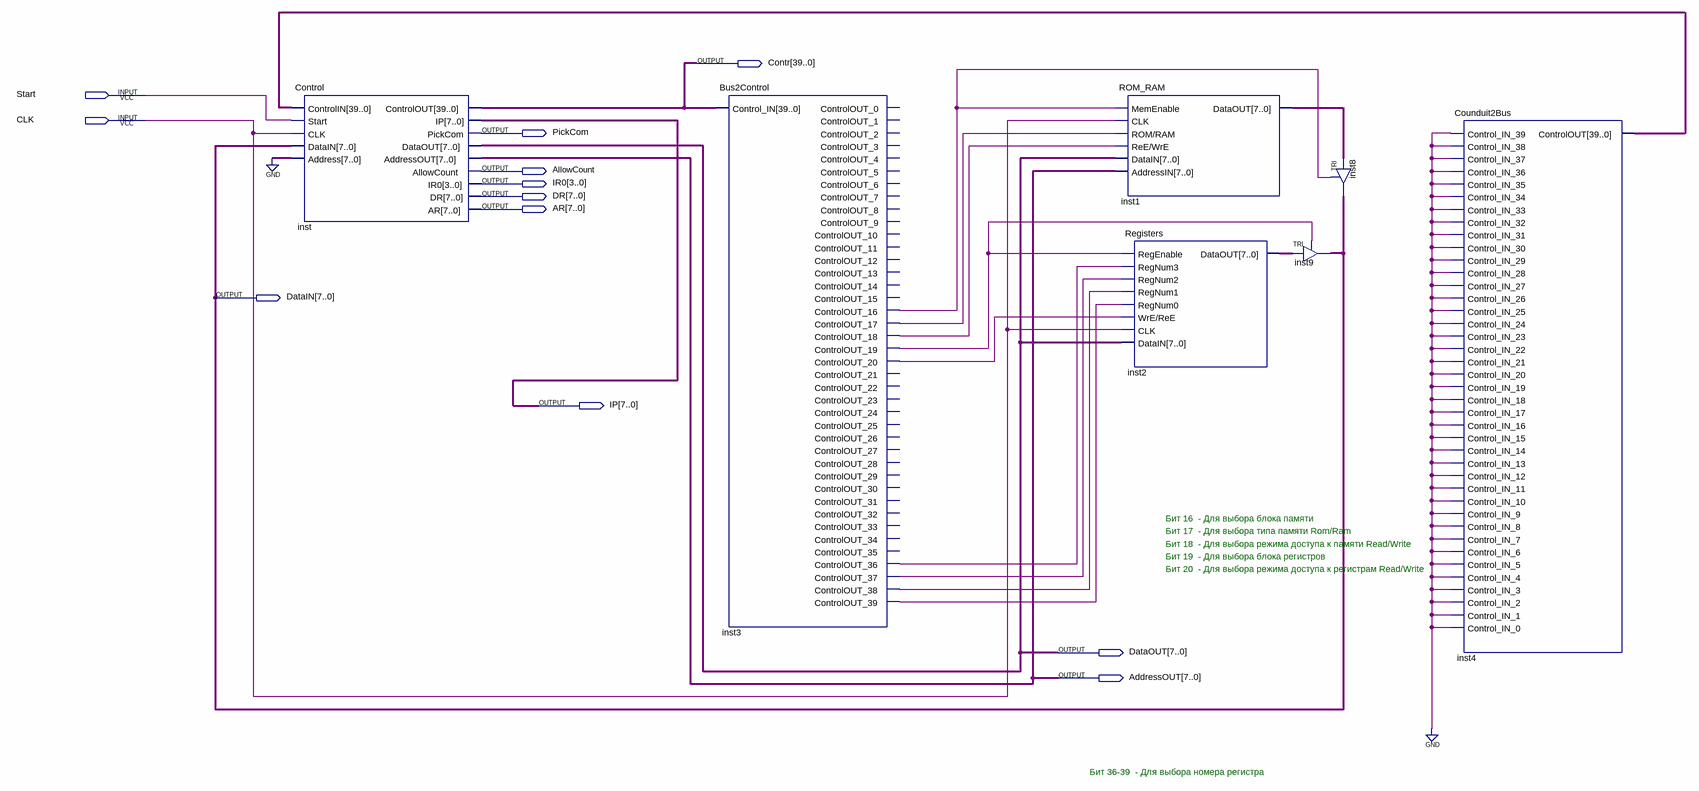
[diagram p0: schematic sheet]
// Quartus schematic lab4.bdf as structural Verilog: 7 symbols, 12 pins
module lab4 (
  input  Start,
  input  CLK,
  output [39:0] Contr,
  output PickCom,
  output AllowCount,
  output [3:0] IR0,
  output [7:0] DR,
  output [7:0] AR,
  output [7:0] DataIN,
  output [7:0] IP,
  output [7:0] DataOUT,
  output [7:0] AddressOUT
);

  wire inst3_controlout_16, inst3_controlout_17, inst3_controlout_18, inst3_controlout_19,
       inst3_controlout_20, inst3_controlout_36, inst3_controlout_37, inst3_controlout_38,
       inst3_controlout_39;
  wire [7:0] inst1_dataout, inst2_dataout;
  wire [39:0] inst4_controlout;

  Control inst (
    .ControlIN(inst4_controlout), .Start(Start), .CLK(CLK), .DataIN(DataIN), .Address({8{1'b0}}),
    .ControlOUT(Contr), .IP(IP), .PickCom(PickCom), .DataOUT(DataOUT), .AddressOUT(AddressOUT),
    .AllowCount(AllowCount), .IR0(IR0), .DR(DR), .AR(AR));
  Bus2Control inst3 (
    .Control_IN(Contr), .ControlOUT_16(inst3_controlout_16), .ControlOUT_17(inst3_controlout_17),
    .ControlOUT_18(inst3_controlout_18), .ControlOUT_19(inst3_controlout_19),
    .ControlOUT_20(inst3_controlout_20), .ControlOUT_36(inst3_controlout_36),
    .ControlOUT_37(inst3_controlout_37), .ControlOUT_38(inst3_controlout_38),
    .ControlOUT_39(inst3_controlout_39));  // open: ControlOUT_0, ControlOUT_1, ControlOUT_2, ControlOUT_3, ControlOUT_4, ControlOUT_5, ControlOUT_6, ControlOUT_7, ControlOUT_8, ControlOUT_9, ControlOUT_10, ControlOUT_11, ControlOUT_12, ControlOUT_13, ControlOUT_14, ControlOUT_15, ControlOUT_21, ControlOUT_22, ControlOUT_23, ControlOUT_24, ControlOUT_25, ControlOUT_26, ControlOUT_27, ControlOUT_28, ControlOUT_29, ControlOUT_30, ControlOUT_31, ControlOUT_32, ControlOUT_33, ControlOUT_34, ControlOUT_35
  ROM_RAM inst1 (
    .MemEnable(inst3_controlout_16), .CLK(CLK), .\ROM/RAM (inst3_controlout_17),
    .\ReE/WrE (inst3_controlout_18), .DataIN(DataOUT), .AddressIN(AddressOUT), .DataOUT(inst1_dataout));
  Registers inst2 (
    .RegEnable(inst3_controlout_19), .RegNum3(inst3_controlout_36), .RegNum2(inst3_controlout_37),
    .RegNum1(inst3_controlout_38), .RegNum0(inst3_controlout_39), .\WrE/ReE (inst3_controlout_20), .CLK(CLK),
    .DataIN(DataOUT), .DataOUT(inst2_dataout));
  TRI inst9[7:0] (.IN(inst2_dataout), .OE(inst3_controlout_19), .OUT(DataIN));
  TRI inst8[7:0] (.IN(inst1_dataout), .OE(inst3_controlout_16), .OUT(DataIN));
  Counduit2Bus inst4 (
    .Control_IN_39(1'b0), .Control_IN_38(1'b0), .Control_IN_37(1'b0), .Control_IN_36(1'b0),
    .Control_IN_35(1'b0), .Control_IN_34(1'b0), .Control_IN_33(1'b0), .Control_IN_32(1'b0),
    .Control_IN_31(1'b0), .Control_IN_30(1'b0), .Control_IN_29(1'b0), .Control_IN_28(1'b0),
    .Control_IN_27(1'b0), .Control_IN_26(1'b0), .Control_IN_25(1'b0), .Control_IN_24(1'b0),
    .Control_IN_23(1'b0), .Control_IN_22(1'b0), .Control_IN_21(1'b0), .Control_IN_20(1'b0),
    .Control_IN_19(1'b0), .Control_IN_18(1'b0), .Control_IN_17(1'b0), .Control_IN_16(1'b0),
    .Control_IN_15(1'b0), .Control_IN_14(1'b0), .Control_IN_13(1'b0), .Control_IN_12(1'b0),
    .Control_IN_11(1'b0), .Control_IN_10(1'b0), .Control_IN_9(1'b0), .Control_IN_8(1'b0),
    .Control_IN_7(1'b0), .Control_IN_6(1'b0), .Control_IN_5(1'b0), .Control_IN_4(1'b0), .Control_IN_3(1'b0),
    .Control_IN_2(1'b0), .Control_IN_1(1'b0), .Control_IN_0(1'b0), .ControlOUT(inst4_controlout));

  // Notes on the sheet:
  //   Бит 16  - Для выбора блока памяти
  //   Бит 17  - Для выбора типа памяти Rom/Ram
  //   Бит 18  - Для выбора режима доступа к памяти Read/Write
  //   Бит 19  - Для выбора блока регистров
  //   Бит 20  - Для выбора режима доступа к регистрам Read/Write
  //   Бит 36-39  - Для выбора номера регистра
endmodule
